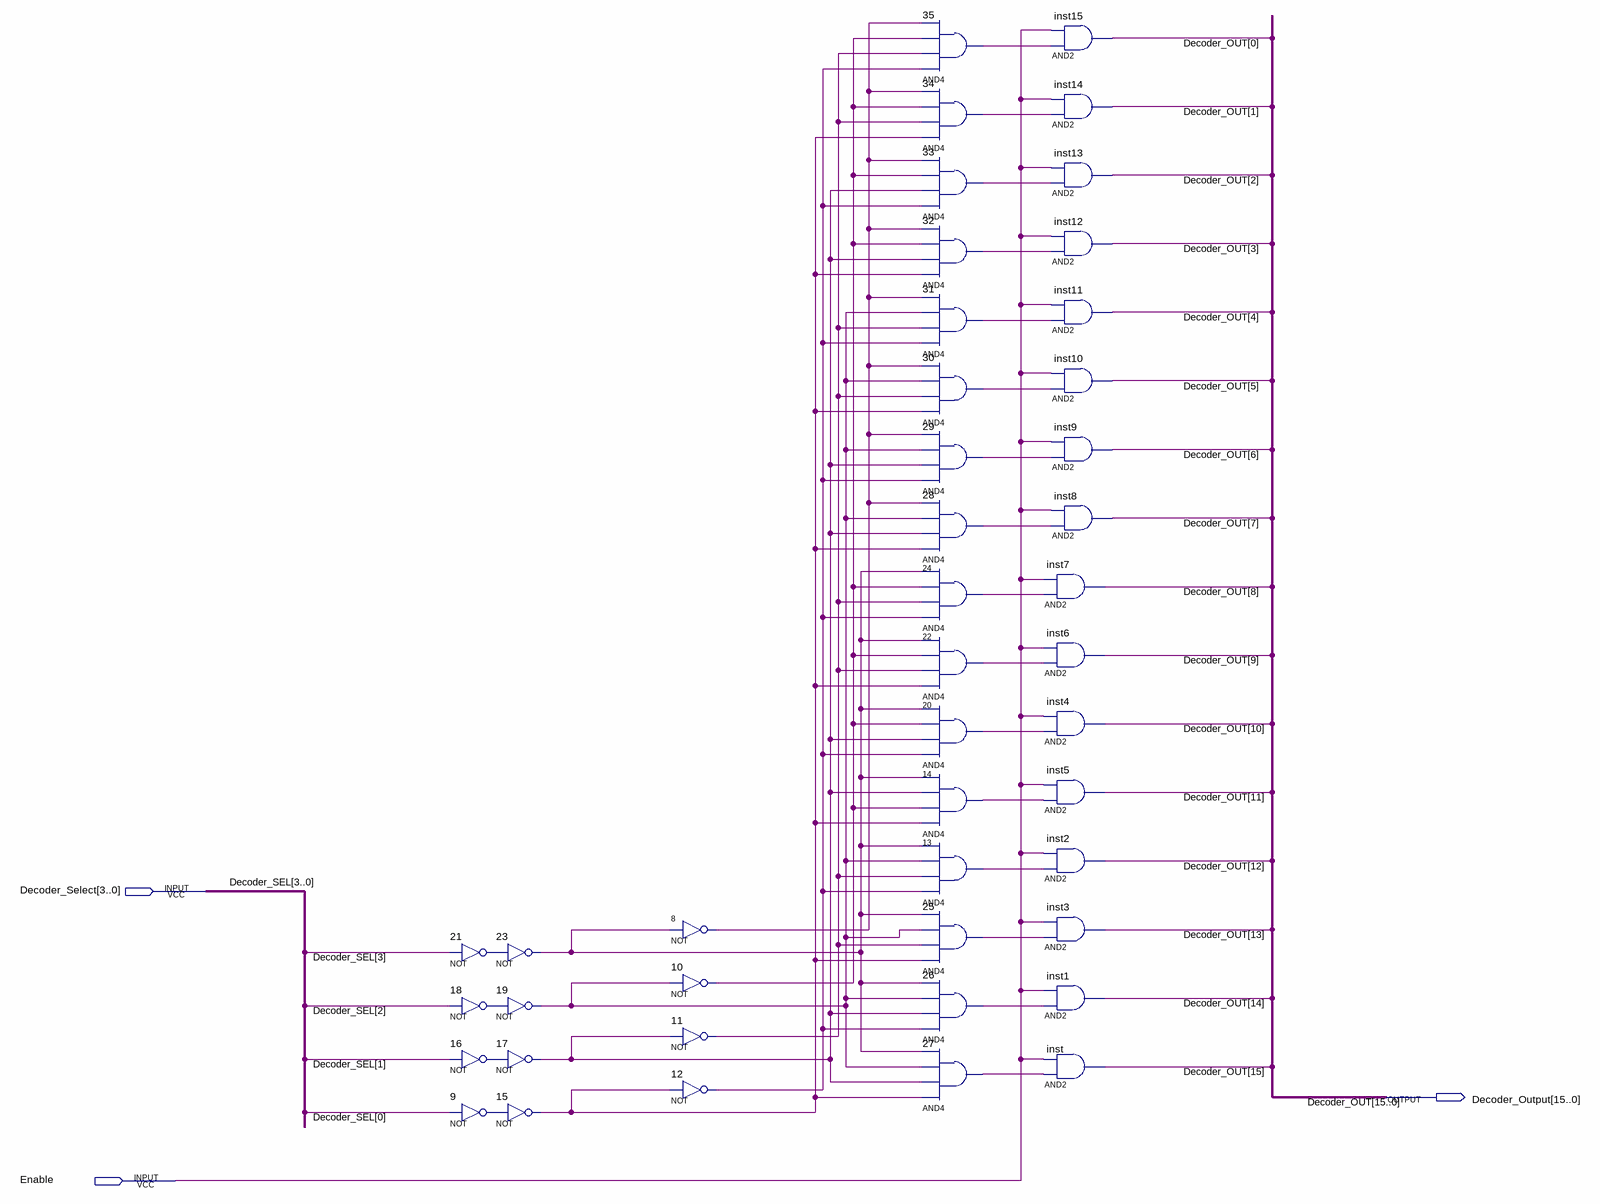
[diagram p0: schematic sheet]
// Quartus schematic 4to16DecoderWithEnable.bdf as structural Verilog: 44 symbols, 3 pins
module \4to16DecoderWithEnable  (
  input  [3:0] Decoder_Select,
  input  Enable,
  output [15:0] Decoder_Output
);

  wire n8_out, n9_out, n10_out, n11_out, n12_out, n13_out, n14_out, n15_out, n16_out, n17_out, n18_out,
       n19_out, n20_out, n21_out, n22_out, n23_out, n24_out, n25_out, n26_out, n27_out, n28_out, n29_out,
       n30_out, n31_out, n32_out, n33_out, n34_out, n35_out;

  not u_21 (n21_out, Decoder_Select[3]);
  not u_23 (n23_out, n21_out);
  not u_18 (n18_out, Decoder_Select[2]);
  not u_19 (n19_out, n18_out);
  not u_16 (n16_out, Decoder_Select[1]);
  not u_17 (n17_out, n16_out);
  not u_9 (n9_out, Decoder_Select[0]);
  not u_15 (n15_out, n9_out);
  not u_8 (n8_out, n23_out);
  not u_10 (n10_out, n19_out);
  not u_11 (n11_out, n17_out);
  not u_12 (n12_out, n15_out);
  and u_35 (n35_out, n12_out, n11_out, n10_out, n8_out);
  and u_34 (n34_out, n15_out, n11_out, n10_out, n8_out);
  and u_33 (n33_out, n12_out, n17_out, n10_out, n8_out);
  and u_32 (n32_out, n15_out, n17_out, n10_out, n8_out);
  and u_31 (n31_out, n12_out, n11_out, n19_out, n8_out);
  and u_30 (n30_out, n15_out, n11_out, n19_out, n8_out);
  and u_29 (n29_out, n12_out, n17_out, n19_out, n8_out);
  and u_28 (n28_out, n15_out, n17_out, n19_out, n8_out);
  and u_24 (n24_out, n12_out, n11_out, n10_out, n23_out);
  and u_22 (n22_out, n15_out, n11_out, n10_out, n23_out);
  and u_20 (n20_out, n12_out, n17_out, n10_out, n23_out);
  and u_14 (n14_out, n15_out, n10_out, n17_out, n23_out);
  and u_13 (n13_out, n12_out, n11_out, n19_out, n23_out);
  and u_25 (n25_out, n15_out, n11_out, n19_out, n23_out);
  and u_26 (n26_out, n12_out, n17_out, n19_out, n23_out);
  and u_27 (n27_out, n15_out, n17_out, n19_out, n23_out);
  and inst15 (Decoder_Output[0], n35_out, Enable);
  and inst14 (Decoder_Output[1], n34_out, Enable);
  and inst13 (Decoder_Output[2], n33_out, Enable);
  and inst12 (Decoder_Output[3], n32_out, Enable);
  and inst11 (Decoder_Output[4], n31_out, Enable);
  and inst10 (Decoder_Output[5], n30_out, Enable);
  and inst9 (Decoder_Output[6], n29_out, Enable);
  and inst8 (Decoder_Output[7], n28_out, Enable);
  and inst7 (Decoder_Output[8], n24_out, Enable);
  and inst6 (Decoder_Output[9], n22_out, Enable);
  and inst4 (Decoder_Output[10], n20_out, Enable);
  and inst5 (Decoder_Output[11], n14_out, Enable);
  and inst2 (Decoder_Output[12], n13_out, Enable);
  and inst3 (Decoder_Output[13], n25_out, Enable);
  and inst1 (Decoder_Output[14], n26_out, Enable);
  and inst (Decoder_Output[15], n27_out, Enable);

  // Other names for the same wires on the sheet: Decoder_OUT[15:0] = Decoder_Output;
  //   Decoder_SEL[3:0] = Decoder_Select
endmodule
